# Altium project PCB GYRO REPETER.PrjPcb
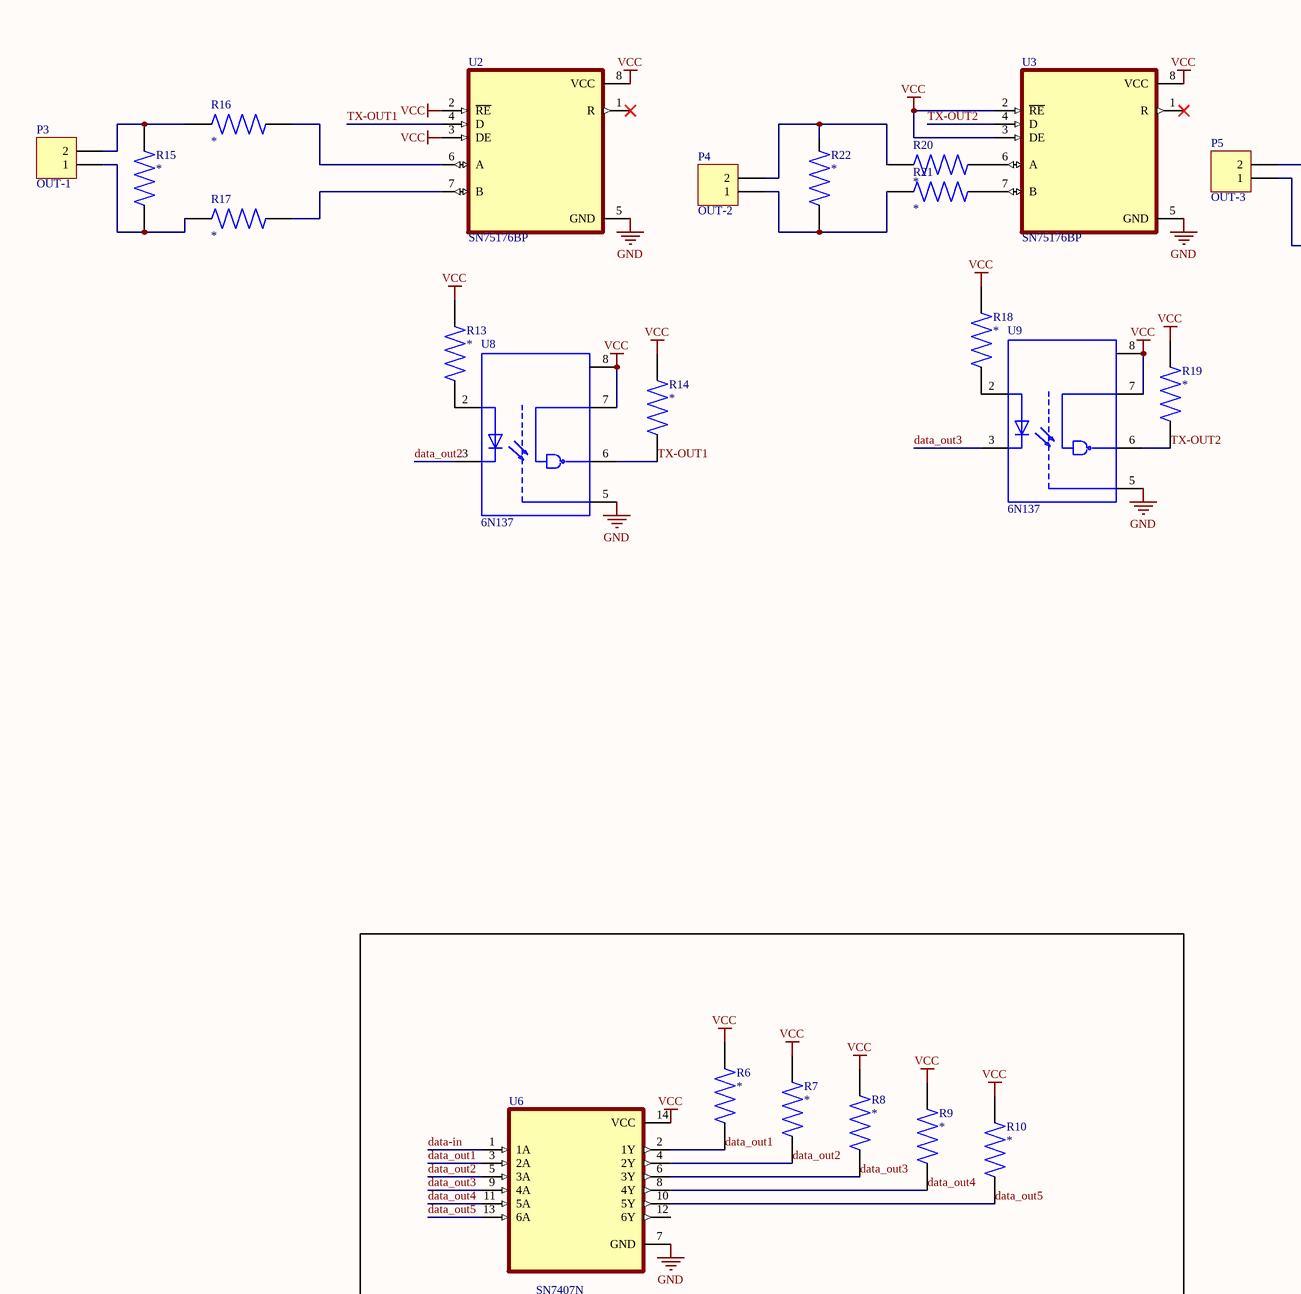
[diagram p0: PCB GYRO REPETER.SchDoc, top left]
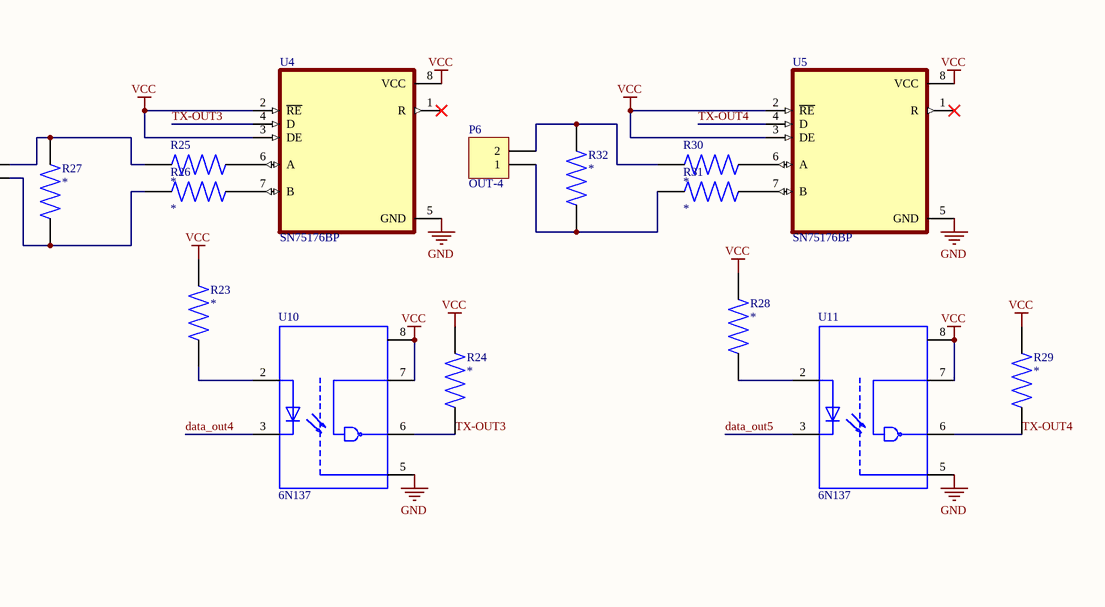
[diagram p1: PCB GYRO REPETER.SchDoc, top right]
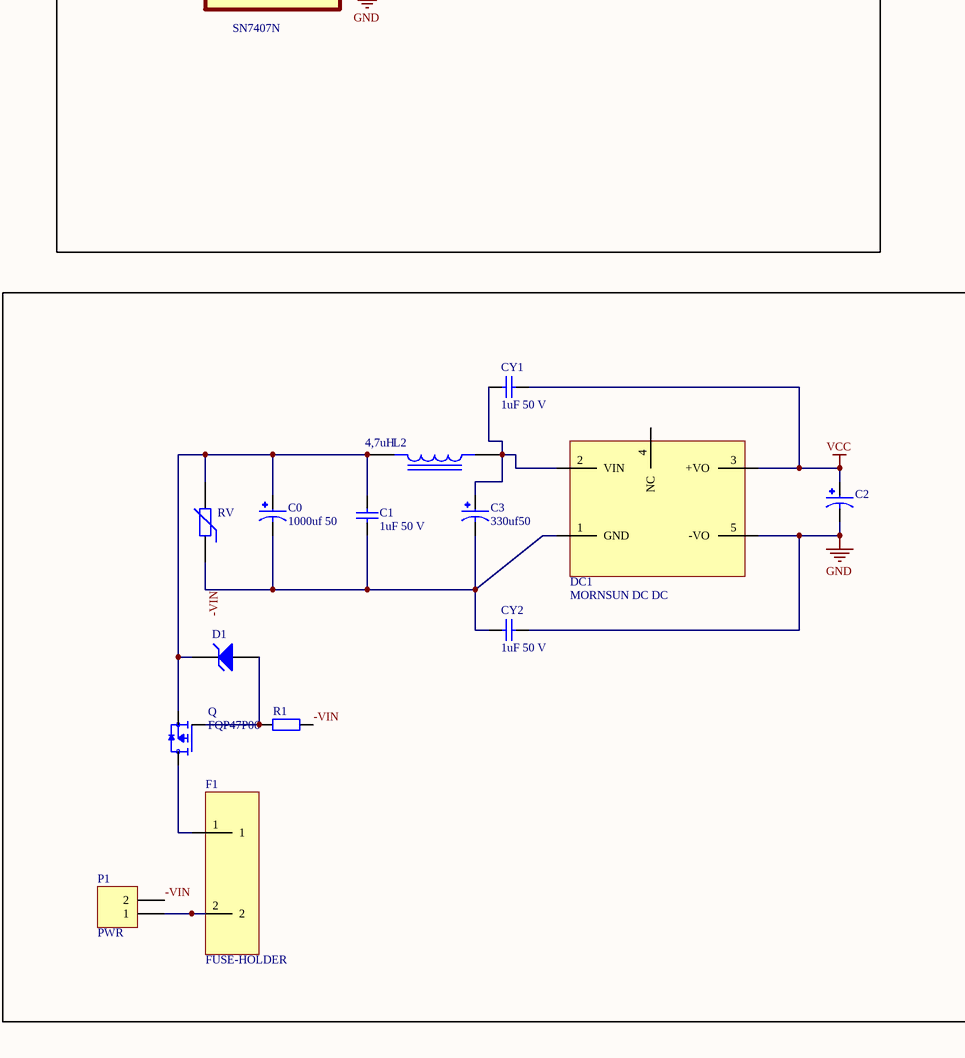
[diagram p2: PCB GYRO REPETER.SchDoc, bottom left]
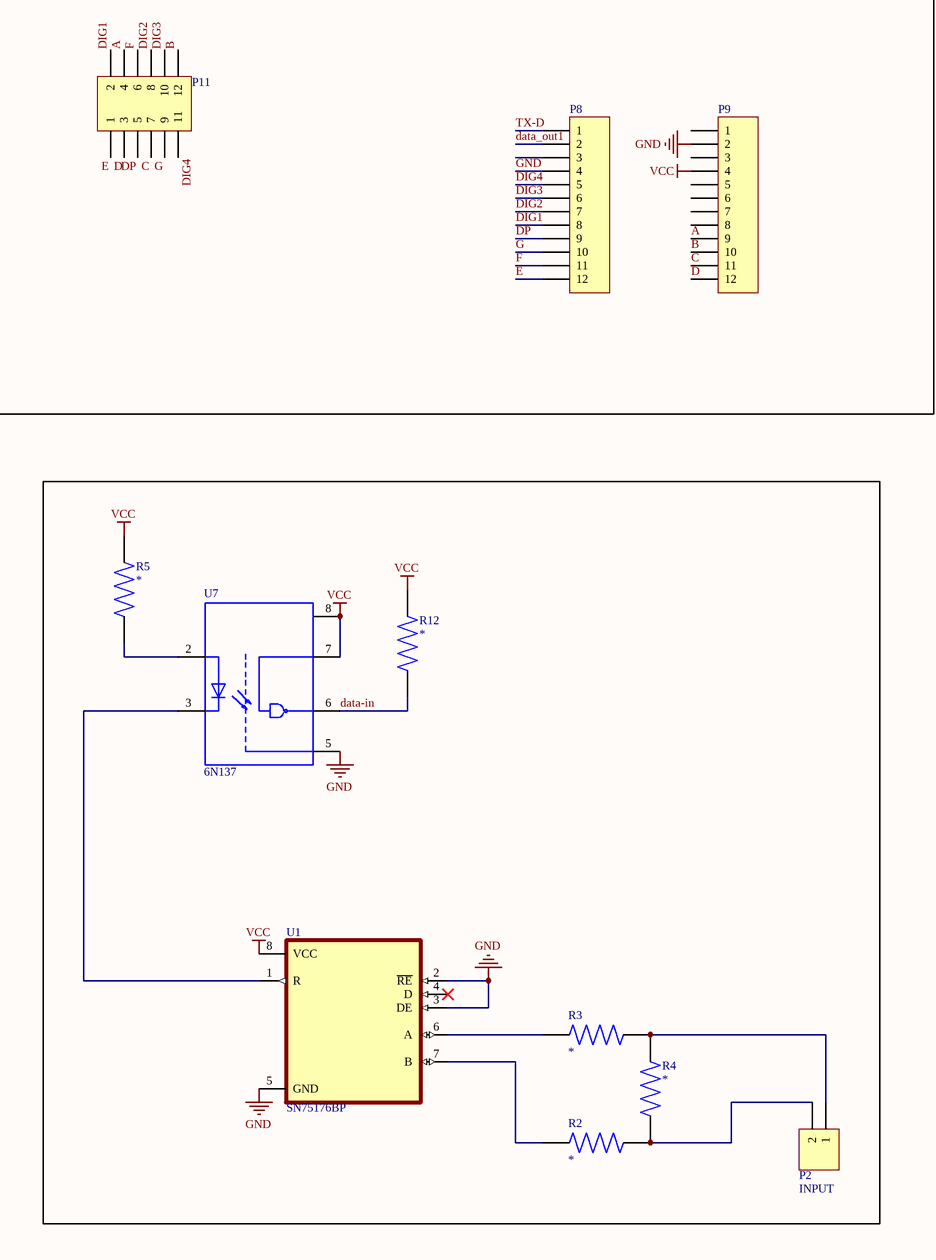
[diagram p3: PCB GYRO REPETER.SchDoc, bottom right]
1 sheet, 63 parts. Net scope: global (net labels, ports and power ports of the same name join across sheets).
Board file: PCB GYRO REPETE-REVISI.PcbDoc

## Sheet PCB GYRO REPETER.SchDoc
size A1

### Parts
C0  1000uf 50  [CAPPRD500W60D1250H2500]
C1  value 1uF 50 V  [RAD-0.2]  (hidden comment: Cap)
C2  EEEFP1C100AR  [CAP_EEEFP1C100AR]  (value not drawn)
C3  330uf50  [CAPPRD500W60D1000H2000]
CY1  value 1uF 50 V  [RAD-0.2]  (hidden comment: Cap)
CY2  value 1uF 50 V  [RAD-0.2]  (hidden comment: Cap)
D1  D Zener  [DIODE-0.7]  (value not drawn)
DC1  MORNSUN DC DC  [DC DC MORNSUN]
F1  FUSE-HOLDER  [Fuse-Holder]
L2  value 4,7uH  [IND_SRR1240-101M]  (hidden comment: SRR1240-101M)
P1  PWR  [Terminal-blok]
P2  INPUT  [Terminal-blok]
P3  OUT-1  [Terminal-blok]
P4  OUT-2  [Terminal-blok]
P5  OUT-3  [Terminal-blok]
P6  OUT-4  [Terminal-blok]
P8  Header 12  [HDR1X12]  (value not drawn)
P9  Header 12  [HDR1X12]  (value not drawn)
P11  Header 6X2  [HDR2X6]  (value not drawn)
Q  FQP47P06  [TO254P1067X483X2286-3]
R1  Res2  [AXIAL-0.4]  (value not drawn)
R2  1623401-1  [RESC2012X65N]  (value not drawn)
R3  1623401-1  [RESC2012X65N]  (value not drawn)
R4  1623401-1  [RESC2012X65N]  (value not drawn)
R5  1623401-1  [RESC2012X65N]  (value not drawn)
R6  1623401-1  [RESC2012X65N]  (value not drawn)
R7  1623401-1  [RESC2012X65N]  (value not drawn)
R8  1623401-1  [RESC2012X65N]  (value not drawn)
R9  1623401-1  [RESC2012X65N]  (value not drawn)
R10  1623401-1  [RESC2012X65N]  (value not drawn)
R12  1623401-1  [RESC2012X65N]  (value not drawn)
R13  1623401-1  [RESC2012X65N]  (value not drawn)
R14  1623401-1  [RESC2012X65N]  (value not drawn)
R15  1623401-1  [RESC2012X65N]  (value not drawn)
R16  1623401-1  [RESC2012X65N]  (value not drawn)
R17  1623401-1  [RESC2012X65N]  (value not drawn)
R18  1623401-1  [RESC2012X65N]  (value not drawn)
R19  1623401-1  [RESC2012X65N]  (value not drawn)
R20  1623401-1  [RESC2012X65N]  (value not drawn)
R21  1623401-1  [RESC2012X65N]  (value not drawn)
R22  1623401-1  [RESC2012X65N]  (value not drawn)
R23  1623401-1  [RESC2012X65N]  (value not drawn)
R24  1623401-1  [RESC2012X65N]  (value not drawn)
R25  1623401-1  [RESC2012X65N]  (value not drawn)
R26  1623401-1  [RESC2012X65N]  (value not drawn)
R27  1623401-1  [RESC2012X65N]  (value not drawn)
R28  1623401-1  [RESC2012X65N]  (value not drawn)
R29  1623401-1  [RESC2012X65N]  (value not drawn)
R30  1623401-1  [RESC2012X65N]  (value not drawn)
R31  1623401-1  [RESC2012X65N]  (value not drawn)
R32  1623401-1  [RESC2012X65N]  (value not drawn)
RV  Res Varistor  [AXIAL-0.4]  (value not drawn)
U1  SN75176BP  [DIP794W45P254L959H508Q8]
U2  SN75176BP  [DIP794W45P254L959H508Q8]
U3  SN75176BP  [DIP794W45P254L959H508Q8]
U4  SN75176BP  [DIP794W45P254L959H508Q8]
U5  SN75176BP  [DIP794W45P254L959H508Q8]
U6  SN7407N  [DIP794W45P254L1969H508Q14]
U7  6N137  [DIP762W50P254L977H451Q8]
U8  6N137  [DIP762W50P254L977H451Q8]
U9  6N137  [DIP762W50P254L977H451Q8]
U10  6N137  [DIP762W50P254L977H451Q8]
U11  6N137  [DIP762W50P254L977H451Q8]

### Nets
GND: C2.2 CY2.1 DC1.5(-VO) P8.4 P9.2 U1.2(~{RE}) U1.3(DE) U1.5(GND) U2.5(GND) U3.5(GND) U4.5(GND) U5.5(GND) U6.7(GND) U7.5(GND) U8.5(GND) U9.5(GND) U10.5(GND) U11.5(GND)
VCC: C2.1 CY1.1 DC1.3(+VO) P9.4 R5.2 R6.2 R7.2 R8.2 R9.2 R10.2 R12.2 R13.2 R14.2 R18.2 R19.2 R23.2 R24.2 R28.1 R29.1 U1.8(VCC) U2.2(~{RE}) U2.3(DE) U2.8(VCC) U3.2(~{RE}) U3.3(DE) U3.8(VCC) U4.2(~{RE}) U4.3(DE) U4.8(VCC) U5.2(~{RE}) U5.3(DE) U5.8(VCC) U6.14(VCC) U7.7(VE) U7.8(VCC) U8.7(VE) U8.8(VCC) U9.7(VE) U9.8(VCC) U10.7(VE) U10.8(VCC) U11.7(VE) U11.8(VCC)
-VIN: C0.N C1.1 C3.N CY2.2 DC1.1(GND) P1.2 R1.1 RV.1
A: P9.9 P11.4
B: P9.10 P11.12
C: P9.11 P11.7
D: P9.12 P11.3
data-in: R12.1 U6.1(1A) U7.6(VO)
data_out1: P8.2 R6.1 U6.2(1Y) U6.3(2A)
data_out2: R7.1 U6.4(2Y) U6.5(3A) U8.3(C)
data_out3: R8.1 U6.6(3Y) U6.9(4A) U9.3(C)
data_out4: R9.1 U6.8(4Y) U6.11(5A) U10.3(C)
data_out5: R10.1 U6.10(5Y) U6.13(6A) U11.3(C)
DIG1: P8.8 P11.2
DIG2: P8.7 P11.8
DIG3: P8.6 P11.10
DIG4: P8.5 P11.11
DP: P8.9 P11.5
E: P8.12 P11.1
F: P8.11 P11.6
G: P8.10 P11.9
TX-D: P8.1
TX-OUT1: R14.1 U2.4(D) U8.6(VO)
TX-OUT2: R19.1 U3.4(D) U9.6(VO)
TX-OUT3: R24.1 U4.4(D) U10.6(VO)
TX-OUT4: R29.2 U5.4(D) U11.6(VO)
NetC0_P: C0.P C1.2 D1.2(K) L2.2 Q.3(S) RV.2
NetC3_P: C3.P CY1.2 DC1.2(VIN) L2.1
NetD1_1: D1.1(A) Q.1(G) R1.2
NetF1_1: F1.1 Q.2(D)
NetF1_2: F1.2 P1.1
NetP2_1: P2.1 R3.1 R4.2
NetP2_2: P2.2 R2.1 R4.1
NetP3_1: P3.1 R15.2 R17.2
NetP3_2: P3.2 R15.1 R16.2
NetP4_1: P4.1 R21.2 R22.2
NetP4_2: P4.2 R20.2 R22.1
NetP5_1: P5.1 R26.2 R27.2
NetP5_2: P5.2 R25.2 R27.1
NetP6_1: P6.1 R31.1 R32.1
NetP6_2: P6.2 R30.1 R32.2
NetR2_2: R2.2 U1.7(B)
NetR3_2: R3.2 U1.6(A)
NetR5_1: R5.1 U7.2(A)
NetR13_1: R13.1 U8.2(A)
NetR16_1: R16.1 U2.6(A)
NetR17_1: R17.1 U2.7(B)
NetR18_1: R18.1 U9.2(A)
NetR20_1: R20.1 U3.6(A)
NetR21_1: R21.1 U3.7(B)
NetR23_1: R23.1 U10.2(A)
NetR25_1: R25.1 U4.6(A)
NetR26_1: R26.1 U4.7(B)
NetR28_2: R28.2 U11.2(A)
NetR30_2: R30.2 U5.6(A)
NetR31_2: R31.2 U5.7(B)
NetU1_1: U1.1(R) U7.3(C)

Not connected (* = marked no-connect by the designer): DC1 4(NC); P8 3; P9 1 3 5 6 7 8; U1 4(D)*; U2 1(R)*; U3 1(R)*; U4 1(R)*; U5 1(R)*; U6 12(6Y)

### Library data of the parts
C0 = EEUHD1H102B: CAP ALUM 1000UF 20% 50V RADIAL; MF: Panasonic; MP: EEU-HD1H102B; Availability: In Stock; Check_prices: https://www.snapeda.com/parts/EEU-HD1H102B/Panasonic/view-part/2335470/?ref=eda; Package: RADIAL-2 Panasonic; Price: None; SnapEDA_Link: https://www.snapeda.com/parts/EEU-HD1H102B/Panasonic/view-part/2335470/?ref=snap; Value: *
C1 CY1 CY2 = Cap: Capacitor; Published: 8-Jun-2000; LatestRevisionDate: 17-Jul-2002; LatestRevisionNote: Re-released for DXP Platform.; PackageReference: RAD-0.3; Publisher: Altium Limited
C2 = EEEFP1C100AR: 10µF 16V Aluminum Electrolytic Capacitors Radial, Can - SMD 850mOhm @ 100kHz 2000 Hrs @ 105°C; Value: 10uF16; MF: Panasonic Electronic; MP: EEE-FP1C100AR; Price: None; Package: RADIAL-2 Panasonic; Purchase-URL: https://pricing.snapeda.com/search/part/EEE-FP1C100AR/?ref=eda; Check_prices: https://www.snapeda.com/parts/EEE-FP1C100AR/Panasonic%20Electronic%20Components/view-part/2301715/?ref=eda; SnapEDA_Link: https://www.snapeda.com/parts/EEE-FP1C100AR/Panasonic%20Electronic%20Components/view-part/2301715/?ref=snap
C3 = EEUFS1H331B: CAP ALUM 330UF 20% 50V RADIAL; MF: Panasonic; Purchase-URL: https://pricing.snapeda.com/search/part/EEUFS1H331B/?ref=eda; Package: RADIAL-2 Panasonic; Check_prices: https://www.snapeda.com/parts/EEUFS1H331B/Panasonic/view-part/5794547/?ref=eda; Price: None; SnapEDA_Link: https://www.snapeda.com/parts/EEUFS1H331B/Panasonic/view-part/5794547/?ref=snap; Availability: In Stock; MP: EEUFS1H331B; Value: *
D1 = D Zener: Zener Diode; Published: 8-Jun-2000; LatestRevisionDate: 17-Jul-2002; LatestRevisionNote: Re-released for DXP Platform.; PackageReference: DIODE-0.7; Publisher: Altium Limited
DC1 = DC-DC MORNSUN
L2 = SRR1240-101M: 100µH Shielded Wirewound Inductor 1.25A 300mOhm Max Nonstandard; MF: Bourns; Purchase-URL: https://pricing.snapeda.com/search/part/SRR1240-101M/?ref=eda; MP: SRR1240-101M; Package: Nonstandard Bourns; Availability: Bad; Price: None; SnapEDA_Link: https://www.snapeda.com/parts/SRR1240-101M/Bourns/view-part/1547372/?ref=snap; Check_prices: https://www.snapeda.com/parts/SRR1240-101M/Bourns/view-part/1547372/?ref=eda
P1-P6 = Header 2: Header, 2-Pin; LatestRevisionDate: 17-Jul-2002; LatestRevisionNote: Re-released for DXP Platform.; Publisher: Altium Limited
P8 P9 = Header 12: Header, 12-Pin; LatestRevisionDate: 17-Jul-2002; LatestRevisionNote: Re-released for DXP Platform.; Publisher: Altium Limited
P11 = Header 6X2: Header, 6-Pin, Dual row; LatestRevisionDate: 17-Jul-2002; LatestRevisionNote: Re-released for DXP Platform.; Publisher: Altium Limited
Q = FQP47P06: P-Channel 60V 47A _Tc_ 160W _Tc_ Through Hole TO-220-3; MF: ON Semiconductor; Value: *; Price: None; Package: TO-220 ON Semiconductor; SnapEDA_Link: https://www.snapeda.com/parts/FQP47P06/ON%20Semiconductor/view-part/1768231/?ref=snap; Availability: Unavailable; MP: FQP47P06
R1 = Res2: Resistor; Value: 1K; Published: 8-Jun-2000; LatestRevisionDate: 17-Jul-2002; LatestRevisionNote: Re-released for DXP Platform.; PackageReference: AXIAL-0.4; Publisher: Altium Limited
R2-R10 R12-R32 = CRG0805ZR: Res Thick Film 0805 0 Ohm Molded SMD SMD T/R; Power_Rating: .125 W; Resistance: 0; Tolerance: 0%; Voltage_Rating: 150 V; MF: TE Connectivity; Package: 0805; Availability: Unavailable; TE_purchase_URL: https://www.te.com/usa-en/product-1623401-1.html?te_bu=Cor&te_type=disp&te_campaign=seda_glo_cor-seda-global-disp-prtnr-fy19-seda-model-bom-cta_sma-317_1&elqCampaignId=32493; MP: CRG0805ZR; EU_RoHS_Compliance: Compliant with Exemptions; SnapEDA_Link: https://www.snapeda.com/parts/CRG0805ZR/TE%20Connectivity%20Passive%20Product/view-part/218184/?ref=snap; Value: *; Price: None; Comment_1: *
RV = Res Varistor: Varistor (Voltage-Sensitive Resistor); Published: 24-Mar-1999; LatestRevisionDate: 29-May-2009; LatestRevisionNote: IPC-7351 Footprint Added.; PackageVersion: Mar-2003; PackageReference: 6-0805; Publisher: Altium Limited; PackageDescription: Chip Resistor 0805 Case Size; Code_IPC: RESC2012
U1-U5 = SN75176BP: Differential bus transceiver 8-PDIP 0 to 70; MF: Texas Instruments; Availability: Good; Package: PDIP-8 Texas; MP: SN75176BP; Value: *; Purchase-URL: https://pricing.snapeda.com/search/part/SN75176BP/?ref=eda; SnapEDA_Link: https://www.snapeda.com/parts/SN75176BP/Texas%20Instruments/view-part/266034/?ref=snap; Price: None; Check_prices: https://www.snapeda.com/parts/SN75176BP/Texas%20Instruments/view-part/266034/?ref=eda
U6 = SN7407N: Búferes / controladores hexagonales con salidas de alto voltaje de colector abierto 14-PDIP 0 a 70; MF: Texas Instruments; Value: *; Availability: Good; MP: SN7407N; Price: None; DigiKey-Purchase-URL: https://snapeda.com/shop?store=DigiKey&id=169270; Package: PDIP-14 Texas Instruments; SnapEDA_Link: https://www.snapeda.com/parts/SN7407N/Texas%20Instruments/view-part/169270/?ref=snap; Mouser-Purchase-URL: https://snapeda.com/shop?store=Mouser&id=169270; BuyPart: https://www.snapeda.com/parts/SN7407N/Texas%20Instruments/view-part/169270/?ref=eda
U7-U11 = 6N137: Optoaislador de salida lógica 10Mbps Open Collector 5000Vrms 1 Channel 5kV / µs CMTI 8-DIP; MF: Everlight Electronics; MP: 6N137; Availability: Unavailable; Package: DIP-8 Broadcom; Value: *; Price: None; SnapEDA_Link: https://www.snapeda.com/parts/6N137/Everlight%20Electronics%20Co%20Ltd/view-part/1771557/?ref=snap